# EAGLE design 0232-carrier-ledz-8 (EAGLE 9.6.2)
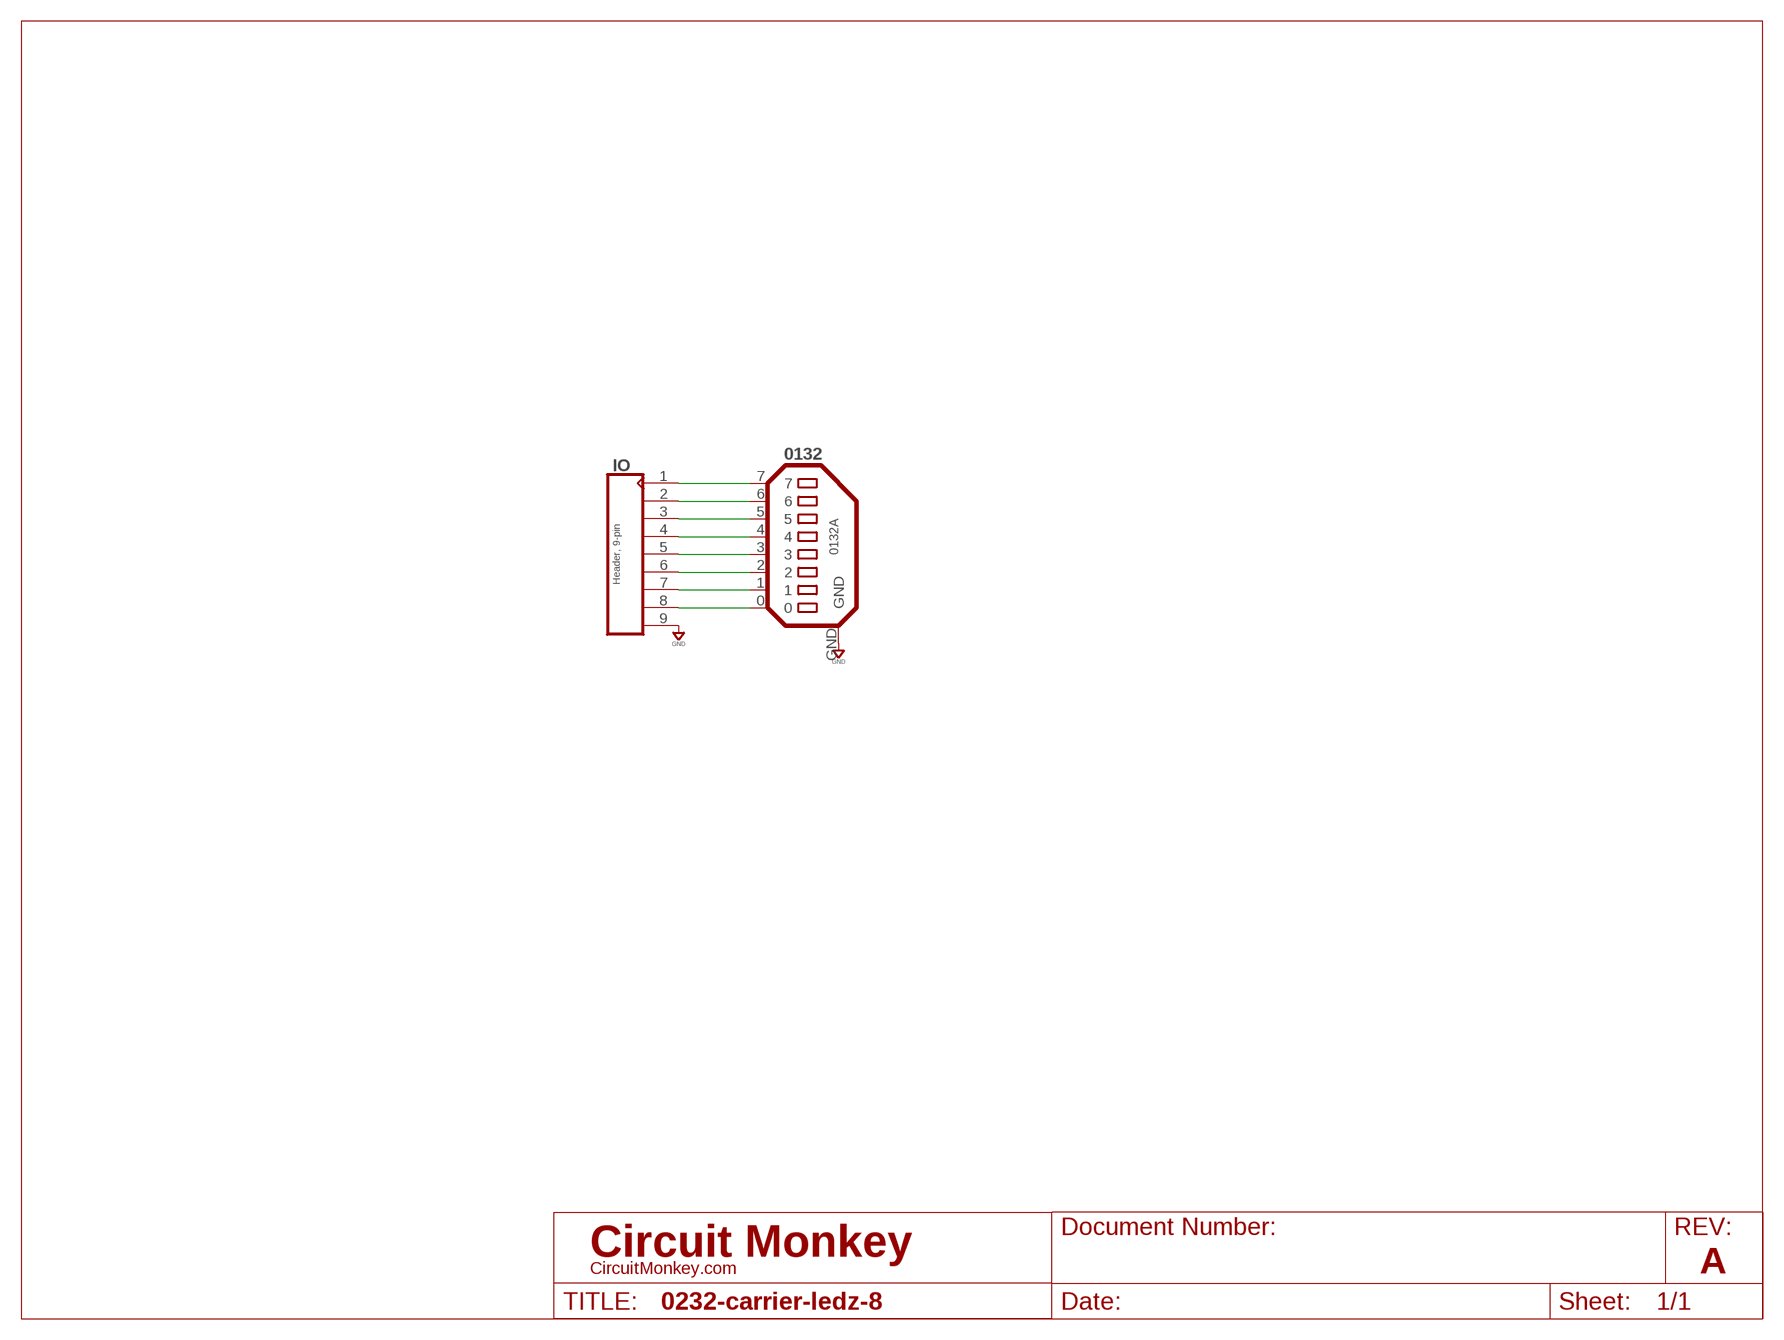
[diagram p0: schematic, sheet 1]
SHEET1 (LETTER_L-CIRCUITMONKEY): DOCUMENT_NAME: 0232 - Carrier for 80-channel LED Bar (0132); REV: A

## Parts
0132  0132A  0132REV-A  [0132A]
IO  Header, 9-pin  CON_09X1-VT-THD  [MA09X1-VT-THD]

## Nets
GND: 0132.GND IO.9
N$1: 0132.2 IO.6
N$2: 0132.3 IO.5
N$3: 0132.4 IO.4
N$4: 0132.5 IO.3
N$5: 0132.6 IO.2
N$6: 0132.7 IO.1
N$7: 0132.1 IO.7
N$8: 0132.0 IO.8

## Library data of the parts
0132 = circuit-monkey-chips:0132: LED Bar, 8-channel; COST01: 2.00; COST10: 1.70; COST100: 1.00; MFR: Circuit Monkey; MPN: 0132A
IO = con-headers:CON_09X1: Connector, 9-pin, 1-row; COST01: 0.15

## Board
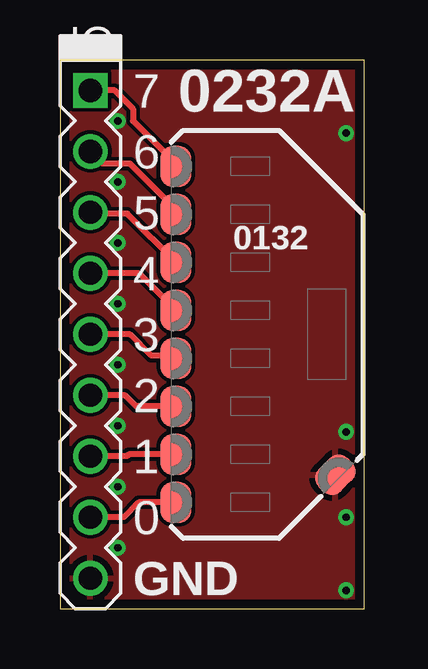
[diagram p1: board, top side]
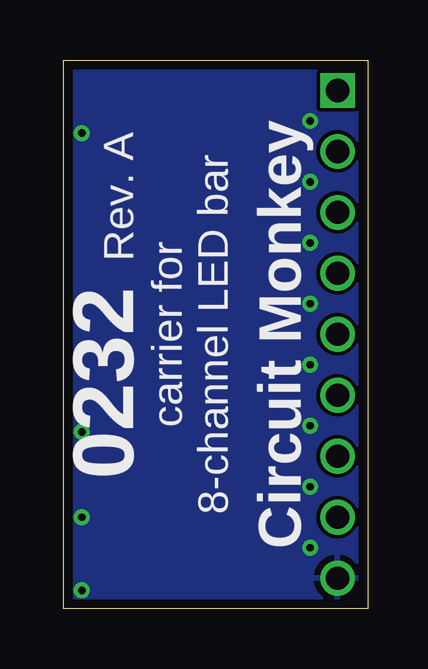
[diagram p2: board, bottom side, seen from below]

Size 12.7 x 22.86 mm. Coordinates in mm from the lower left corner, seen from the top.
Outline: 0,0 12.7,0 12.7,22.86 0,22.86 0,0
Copper layers (1*16): Top 0.0356mm / dielectric 1.5011mm / Bottom 0.0356mm
Design rules "OSH-CircuitMonkey": minimum track width 6mil, minimum drill 12mil, track to track 6mil, track to pad 6mil, pad to pad 6mil, via to via 6mil, smd to smd 6mil, copper to edge 15mil, drill to drill 6mil, minimum pad ring 7mil, minimum via ring 7mil, stop-mask expansion 3mil, vias tented up to drill 13mil, thermal gap 10mil

### Footprints (pad centres in the part's own frame; a part is rotated, then mirrored left to right if it is on the bottom)
0132A = smd 1.3 x 1.7: 0 -3.8,-7; 1 -3.8,-5; 2 -3.8,-3; 3 -3.8,-1; 4 -3.8,1; 5 -3.8,3; 6 -3.8,5; 7 -3.8,7 | smd 1.3 x 1.7 rotated 315: GND 2.85,-5.85
MA09X1-VT-THD = drill 0.965 square: 1 -10.16,0 | drill 0.965: 2 -7.62,0; 3 -5.08,0; 4 -2.54,0; 5 0,0; 6 2.54,0; 7 5.08,0; 8 7.62,0; 9 10.16,0

### Placement (x,y rotation side)
0132  8.64,11.43 0 top
IO  1.27,11.43 270 top

### Tracks (layer width: path | path; a pad name or v marks a point on that pad's centre or on a via)
GND  (via drill 0.3)
  other vias: 2.41,20.32 2.41,17.78 2.41,15.24 2.41,12.7 2.41,10.16 2.41,7.62 2.41,5.08 2.41,2.54 11.94,0.76 11.94,7.37 11.94,3.81 11.94,19.81
  pour Top: 0,0 0,22.86 12.7,22.86 12.7,0
  pour Bottom: 12.7,0 12.7,22.86 0,22.86 0,0
N$1
  Top 0.254: 0132.2 3.19,8.43 2.73,8.89 IO.6
N$2
  Top 0.254: 0132.3 4.72,10.54 3.81,10.54 2.92,11.43 IO.5
N$3
  Top 0.254: 0132.4 3.3,13.97 IO.4
N$4
  Top 0.254: 0132.5 2.8,16.46 1.32,16.46 IO.3
N$5
  Top 0.254: 0132.6 4.84,16.63 2.92,18.54 1.78,18.54 IO.2
N$6
  Top 0.254: 0132.7 4.84,18.53 3.05,20.32 3.05,20.83 2.29,21.59 IO.1
N$7
  Top 0.254: 0132.1 2.87,6.43 2.79,6.35 IO.7
N$8
  Top 0.254: 0132.0 3.29,4.43 2.67,3.81 IO.8

### Text on the board
tPlace: 7 | 0232A | 6 | 5 | 4 | 3 | 2 | 1 | 0 | GND
bPlace: Rev. A | Circuit Monkey | carrier for / 8-channel LED bar | 0232